# Altium schematic sheet Program_Debug-Interface.SchDoc
size A3
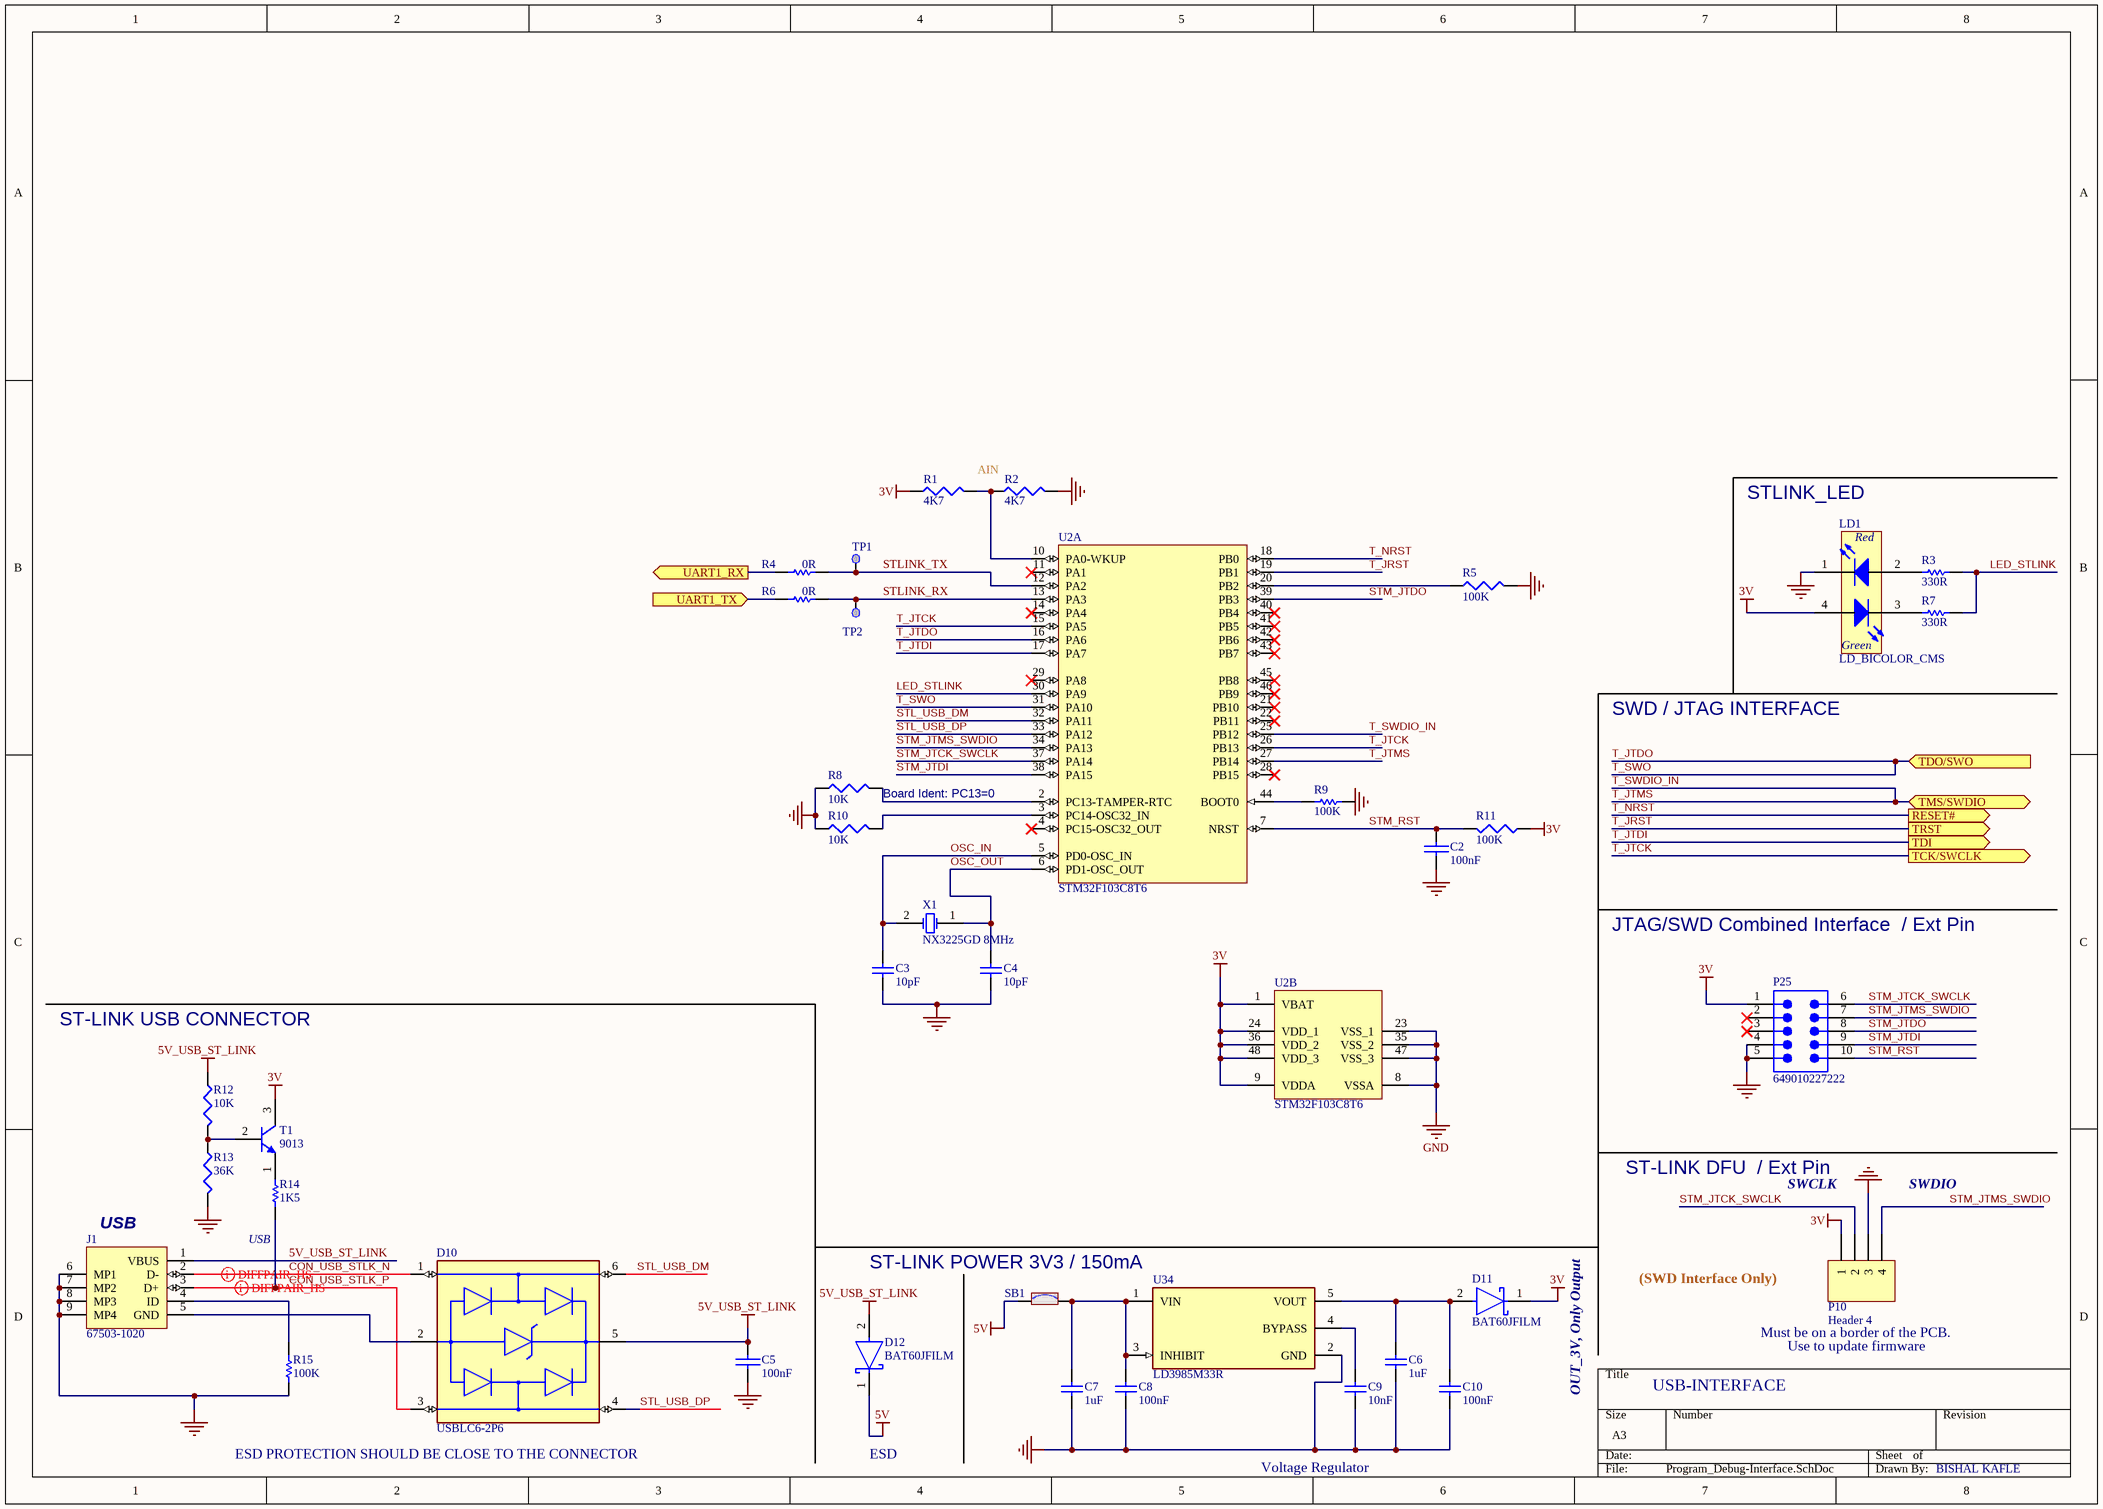
[diagram p0: Program_Debug-Interface.SchDoc]

## Parts
C2  100nF  [0603C]
C3  value 10pF  [C0402]
C4  value 10pF  [C0402]
C5  100nF  [0603C]
C6  value 1uF  [C0603]
C7  value 1uF  [C0603]
C8  value 100nF  [C0402]
C9  value 10nF  [C0402]
C10  value 100nF  [C0402]
D10  USBLC6-2P6  [FP-SOT-666-MFG]
D11  BAT60JFILM  [FP-BAT60JFILM-MFG]
D12  BAT60JFILM  [FP-BAT60JFILM-MFG]
J1  67503-1020  [MOLX-67503-1020_V]
LD1  value LD_BICOLOR_CMS  [LED_BI-GR_HSMF-A201-A00J1]
P10  Header 4  [HDR1X4]
P25  649010227222  [649010227222]
R1  4K7  [0603R]
R2  4K7  [0603R]
R3  value 330R  [R0402]
R4  value 0R  [R0402]
R5  100K  [0603R]
R6  value 0R  [R0402]
R7  value 330R  [R0402]
R8  10K  [0603R]
R9  value 100K  [R0402]
R10  10K  [0603R]
R11  100K  [0603R]
R12  10K  [0603R]
R13  36K  [0603R]
R14  1K5  [0603R]
R15  value 100K  [R0402]
SB1  (no value)  [SOLDER-BRIDGE_R0603-0R]
T1  9013  [SOT23-213]
TP1  Test Point  [TP_SMD_1MM]  (value not drawn)  (no BOM)
TP2  Test Point  [TP_SMD_1MM]  (value not drawn)  (no BOM)
U2  STM32F103C8T6  [STM-LQFP48_L]  (parts A,B of 2)
U34  LD3985M33R  [FP-SOT23-5L-7049676-MFG]
X1  value NX3225GD 8MHz  [CRY_NX3225GD_2P]

## Ports
RESET# (out), TCK/SWCLK (out), TDI (out), TDO/SWO (in), TMS/SWDIO (bidir), TRST (out), UART1_RX (out), UART1_TX (in)

## Nets
3V: D11.1(K) LD1.4(YellowGreen_anode) P10.1 P25.1 R1.1 R11.2 T1.3(C) U2.1(VBAT) U2.9(VDDA) U2.24(VDD_1) U2.36(VDD_2) U2.48(VDD_3)
5V: D12.1(K) SB1.1
5V_USB_ST_LINK: C5.1 D10.5(VBUS) D12.2(A) J1.1(VBUS) R12.1
GND: C2.1 C3.2 C4.2 C5.2 C6.1 C7.2 C8.1 C9.1 C10.1 J1.6(MP1) J1.7(MP2) J1.8(MP3) J1.9(MP4) LD1.1(RED_cathode) P10.3 P25.4 P25.5 R2.2 R5.2 R8.1 R10.1 R13.2 R15.1 U2.8(VSSA) U2.23(VSS_1) U2.35(VSS_2) U2.47(VSS_3) U34.2(GND)
CON_USB_STLK_N: D10.1(I/O1) J1.2(D-)
CON_USB_STLK_P: D10.3(I/O2) J1.3(D+) R14.2
LED_STLINK: R3.2 R7.2 U2.30(PA9)
OSC_IN: C3.1 U2.5(PD0-OSC_IN) X1.2(OSC2)
OSC_OUT: C4.1 U2.6(PD1-OSC_OUT) X1.1(OSC1)
STL_USB_DM: D10.6(I/O1) U2.32(PA11)
STL_USB_DP: D10.4(I/O2) U2.33(PA12)
STLINK_RX: R6.2 TP2.1 U2.13(PA3)
STLINK_TX: R4.1 TP1.1 U2.12(PA2)
STM_JTCK_SWCLK: P10.2 P25.6 U2.37(PA14)
STM_JTDI: P25.9 U2.38(PA15)
STM_JTDO: P25.8 U2.39(PB3)
STM_JTMS_SWDIO: P10.4 P25.7 U2.34(PA13)
STM_RST: C2.2 P25.10 R11.1 U2.7(NRST)
T_JRST: U2.19(PB1) ; port TRST
T_JTCK: U2.15(PA5) U2.26(PB13) ; port TCK/SWCLK
T_JTDI: U2.17(PA7) ; port TDI
T_JTDO: U2.16(PA6) U2.31(PA10) ; port TDO/SWO  [also labelled T_SWO]
T_JTMS: U2.25(PB12) U2.27(PB14) ; port TMS/SWDIO  [also labelled T_SWDIO_IN]
T_NRST: U2.18(PB0) ; port RESET#
UART1_RX: R4.2 ; port UART1_RX
UART1_TX: R6.1 ; port UART1_TX
NetC6_2: C6.2 C10.2 D11.2(A) U34.5(VOUT)
NetC7_1: C7.1 C8.2 SB1.2 U34.1(VIN) U34.3(INHIBIT)
NetC9_2: C9.2 U34.4(BYPASS)
NetD10_2: D10.2(GND) J1.5(GND)
NetJ1_4: J1.4(ID) R15.2
NetLD1_2: LD1.2(Red_anode) R3.1
NetLD1_3: LD1.3(YellowGreen_cathode) R7.1
NetR1_2: R1.2 R2.1 U2.10(PA0-WKUP)
NetR5_1: R5.1 U2.20(PB2)
NetR8_2: R8.2 U2.2(PC13-TAMPER-RTC)
NetR9_2: R9.2 U2.44(BOOT0)
NetR10_2: R10.2 U2.3(PC14-OSC32_IN)
NetR12_2: R12.2 R13.1 T1.2(B)

Not connected (* = marked no-connect by the designer): P25 2* 3*; R9 1; R14 1; T1 1(E); U2 4(PC15-OSC32_OUT)* 11(PA1)* 14(PA4)* 21(PB10)* 22(PB11)* 28(PB15)* 29(PA8)* 40(PB4)* 41(PB5)* 42(PB6)* 43(PB7)* 45(PB8)* 46(PB9)*

## Layout directives
differential pair: CON_USB_STLK_N, CON_USB_STLK_P

## Notes on the sheet
- AIN
- STLINK_LED
- SWD / JTAG INTERFACE
- (near R8) Board Ident: PC13=0
- JTAG/SWD Combined Interface  / Ext Pin
- ST-LINK USB CONNECTOR
- ST-LINK DFU  / Ext Pin
- SWCLK
- SWDIO
- (near J1) USB
- (near R14) USB
- (near SB1) ST-LINK POWER 3V3 / 150mA
- (SWD Interface Only)
- OUT_3V, Only Output
- USB-INTERFACE
- Must be on a border of the PCB.
- Use to update firmware
- (near D10) ESD PROTECTION SHOULD BE CLOSE TO THE CONNECTOR
- ESD
- Voltage Regulator
- BISHAL KAFLE
- Labels drawn without touching a wire or pin: GND
- (in symbol MCD-00051) Red; Green

## Library data of the parts
C2 = CAP
C3 C4 = MCD-00015: Capacitor,10pF,50V,NPO,5%,0402; Manufacturer_Part_Number: CC0402JRNPO9BN100; Manufacturer: YAGEO; Provided_By: SUBCO; Initial_Board_Reference: mb1274; Internal_Part_Number: MCD-00015; ComponentLink1Description: Datasheet; ECCN_US: n/a; ECCN_EU: n/a; Status: Released; Part_Type: Capacitor; Package: C0402; ComponentLink1URL: http://tunmcdsvn.tun.st.com/Component_Datasheet_Library/Trunk/Capacitors/Yageo_Capacitor_NP0_16V-to-50V
C5 = CAP: Capacitor
C6 C7 = MCD-00238: Capacitor,1uF,6V3,X5R,10%,0603; Manufacturer_Part_Number: CC0603KRX5R5BB105; Manufacturer: YAGEO; Provided_By: SUBCO; Initial_Board_Reference: mb1319; Internal_Part_Number: MCD-00238; ComponentLink1Description: Datasheet; ECCN_US: n/a; ECCN_EU: n/a; Status: Released; Part_Type: Capacitor; Package: C0603; ComponentLink1URL: http://tunmcdsvn.tun.st.com/Component_Datasheet_Library/Trunk/Capacitors/Yageo_Multilayer_capacitor_X5R_series_100pF_to_100uF
C8 C10 = MCD-00006: Capacitor,100nF,16V,X7R,10%,0402; Manufacturer_Part_Number: CC0402KRX7R7BB104; Manufacturer: YAGEO; Alternate_Manufacturer: MURATA; Alternate_Manufacturer_Part_Number: GCM155R71C104KA55D; Provided_By: SUBCO; Initial_Board_Reference: mb1274; Internal_Part_Number: MCD-00006; ComponentLink1Description: Datasheet; ECCN_US: n/a; ECCN_EU: n/a; Status: Released; Part_Type: Capacitor; Package: C0402; ComponentLink1URL: http://tunmcdsvn.tun.st.com/Component_Datasheet_Library/Trunk/Capacitors/Yageo_Multilayer_Capacitor_X7R_series_100pF_to_22uF
C9 = MCD-00011: Capacitor,10nF,16V,X7R,10%,0402; Manufacturer_Part_Number: CC0402KRX7R7BB103; Manufacturer: YAGEO; Provided_By: SUBCO; Initial_Board_Reference: mb1274; Internal_Part_Number: MCD-00011; ComponentLink1Description: Datasheet; ECCN_US: n/a; ECCN_EU: n/a; Status: Released; Part_Type: Capacitor; Package: C0402; ComponentLink1URL: http://tunmcdsvn.tun.st.com/Component_Datasheet_Library/Trunk/Capacitors/Yageo_Multilayer_Capacitor_X7R_series_100pF_to_22uF
D10 = CMP-12225-000058-1: TVS DIODE 5.25V 17V SOT666; Min Breakdown Voltage: 6V; Power Line Protection: Yes; Element Configuration: Dual; Test Current: 1mA; Working Voltage: 5V; Number of Channels: 2; Max Reverse Leakage Current: 150nA; Direction: Unidirectional; Peak Pulse Current: 5A; Number of Elements: 1; Capacitance: 3.5pF; Max Breakdown Voltage: 6V; Height: 0.6mm; Depth: 1.3mm; Contact Plating: Tin; Reverse Breakdown Voltage: 6V; REACH SVHC: No SVHC; Operating Supply Voltage: 5V; Width: 1.3mm; Max Operating Temperature: 125°C; Reverse Standoff Voltage: 5V; ESD Protection: Yes; Package Quantity: 1; Termination: SMD/SMT; Length: 1.7mm; Leakage Current: 150nA; Number of Bidirectional Channels: 2; Case/Package: SOT-666; Min Operating Temperature: -40°C; Number of Pins: 6; Clamping Voltage: 17V; Breakdown Voltage: 6V; Lead Free: Lead Free; Radiation Hardening: No; Packaging: Tape and Reel; Mount: Surface Mount; Polarity: Unidirectional
D11 D12 = CMP-12187-000028-1: DIODE SCHOTTKY 10V 3A SOD323; Max Forward Surge Current (Ifsm): 5A; Forward Voltage: 580mV; Max Reverse Leakage Current: 7.5uA; Element Configuration: Single; Polarity: Standard; Output Current: 3A; Contact Plating: Tin; Package Quantity: 1; Mount: Surface Mount; Min Operating Temperature: -65°C; Average Rectified Current: 3A; Packaging: Tape and Reel; Forward Current: 3A; Height: 1.07mm; Length: 1.8mm; REACH SVHC: No SVHC; Peak Non-Repetitive Surge Current: 5A; Max Surge Current: 5A; Width: 1.45mm; Current Rating: 3A; Lead Free: Lead Free; Radiation Hardening: No; Max Reverse Voltage (DC): 10V; Peak Reverse Current: 7.5uA; Voltage Rating (DC): 10V; Max Operating Temperature: 150°C; Max Repetitive Reverse Voltage (Vrrm): 10V; Number of Pins: 2; Weight: 0.01lb
J1 = MOLX-67503-1020: USB, MINI, SMD, RA KME04-USBMU03A01; Manufacturer: Molex; ComponentLink1URL: http://www.molex.com/; PartNumber: 67503-1020; Mounting Technology: Surface Mount; ComponentLink1Description: Manufacturer URL; Terminal Pitch: 0.8 mm; DatasheetVersion: Rev F, 06/2009; ComponentLink2Description: Datasheet; PackageDescription: Mini USB Connector, SMT, Righer Angle; ComponentLink2URL: http://www.molex.com/pdm_docs/sd/675031020_sd.pdf; PackageReference: 67503-1020
LD1 = MCD-00051: LED Bicolor; Manufacturer_Part_Number: HSMF-A201-A00J1; Manufacturer: AVAGO TECHNOLOGIES; Alternate_Manufacturer_Part_Number: LE-RGW35280; Alternate_Manufacturer: EVERLUCK; Part_Type: Display; ECCN_US: EAR99; ECCN_EU: NEC; Provided_By: SUBCO; Initial_Board_Reference: mb1274; Internal_Part_Number: MCD-00051; ComponentLink1Description: Datasheet; Status: Released; ComponentLink1URL: http://tunmcdsvn.tun.st.com/Component_Datasheet_Library/Trunk/Display/Avago_LED-SMC_HSMx-A2xx-02Feb2012
P10 = Header 4: Header, 4-Pin Male; MPN: PEC04SFAN; PN: S1212E-04-ND; URL: http://www.digikey.ca/product-detail/en/PEC04SFAN/S1212E-04-ND
P25 = CMP-1502-00532-2: NexarPartId: 8917592; Number of Positions: 10; Operating Supply Voltage: 600V; Pitch: 4.2mm; Gender: Male; Row Spacing: 5.5118mm; Contact Resistance: 10mΩ; Connector Type: Male Pin, Socket; Insulation: Insulated; Insulation Resistance: 1GΩ; Current Rating: 7A; Contact Plating: Tin; Fastening Type: Ramp; Lead Pitch: 4.2mm; Number of Pins: 10; Contact Gender: Male; Termination: Through Hole; Length: 22.2mm; Max Operating Temperature: 105°C; Housing Material: Nylon; Contact Material: Copper; Voltage Rating: 600V; REACH SVHC: Unknown; Flammability Rating: UL94 V-0; RoHS: Compliant; Height: 12.8mm; Width: 22.3mm; Color: White; Mount: Through Hole; Min Operating Temperature: -40°C; Number of Rows: 2; Number of Contacts: 10
R1 R2 R5 R11 = RES1
R3 R7 = MCD-00062: Resistor,330R,0402,1%,1/16W; Manufacturer_Part_Number: RC0402FR-07330RL; Manufacturer: YAGEO; Provided_By: SUBCO; Initial_Board_Reference: mb1274; Internal_Part_Number: MCD-00062; ComponentLink1Description: Datasheet; ECCN_US: n/a; ECCN_EU: n/a; Status: Released; Part_Type: Resistor; ComponentLink1URL: http://tunmcdsvn.tun.st.com/Component_Datasheet_Library/Trunk/Resistors/Yageo_Resistor_RC0402-series; Package: R0402
R4 R6 = MCD-00052: Resistor,0R,0402,5%,1/16W; Manufacturer_Part_Number: RC0402JR-070RL; Manufacturer: YAGEO; Provided_By: SUBCO; Initial_Board_Reference: mb1274; Internal_Part_Number: MCD-00052; ComponentLink1Description: Datasheet; ECCN_US: n/a; ECCN_EU: n/a; Status: Released; Part_Type: Resistor; ComponentLink1URL: http://tunmcdsvn.tun.st.com/Component_Datasheet_Library/Trunk/Resistors/Yageo_Resistor_RC0402-series; Package: R0402
R8 R10 R12 R13 = R: Right: 20; Bottom: 30
R9 R15 = MCD-00059: Resistor,100K,0402,1%,1/16W; Manufacturer_Part_Number: RC0402FR-07100KL; Manufacturer: YAGEO; Alternate_Manufacturer_Part_Number: RT0402FRE07100KL; Provided_By: SUBCO; Initial_Board_Reference: mb1274; Internal_Part_Number: MCD-00059; Alternate_Manufacturer: YAGEO; ComponentLink1Description: Datasheet; ECCN_US: n/a; ECCN_EU: n/a; Status: Released; Part_Type: Resistor; ComponentLink1URL: http://tunmcdsvn.tun.st.com/Component_Datasheet_Library/Trunk/Resistors/Yageo_Resistor_RC0402-series; Package: R0402
R14 = Res1: Resistor; Value: 1K; Published: 8-Jun-2000; Revision: July-2002: Re-released for DXP Platform.; Publisher: Altium Limited
SB1 = MCD-00071: Solder Bridge ON; Part_Type: Mechanical; Manufacturer: YAGEO; Manufacturer_Part_Number: RC0603JR-070RL; Provided_By: SUBCO; Initial_Board_Reference: mb1274; Internal_Part_Number: MCD-00071; ECCN_US: n/a; ECCN_EU: n/a; Status: Released; ComponentLink1Description: Datasheet; ComponentLink1URL: http://tunmcdsvn.tun.st.com/Component_Datasheet_Library/Trunk/Resistors/Yageo_Resistor_RC0603-series; Package: SB0603
T1 = NPN: NPN Bipolar Transistor; Code - JEDEC: TO-226-AA; Published: 8-Jun-2000; Revision: July-2002: Re-released for DXP Platform.; Publisher: Altium Limited
TP1 TP2 = MCD-00074: Test Point 1mm; Part_Type: Mechanical; Initial_Board_Reference: MB1274; Internal_Part_Number: MCD-00074; Status: Released; Manufacturer_Part_Number: n/a; Manufacturer: n/a; ComponentLink1Description: Datasheet; ComponentLink1URL: http://na; ECCN_US: n/a; ECCN_EU: n/a; Provided_By: n/a
U2 = CMP-0237-00215-3: ARM Cortex-M3 32-bit MCU, 64 KB Flash, 20 KB Internal RAM, 37 I/Os, 48-pin LQFP, -40 to 85 degC, Tray; Supply Voltage(Vcc) min (V): 2; Internal RAM Size (kB): 20; FLASH Size (Prog) (kB): 64; A/D Converter: 2x12-bit (10 Channel); I/Os (High Current): 37; Operating Frequency(F) (Processor speed) (MHz): 72; Core: ARM Cortex-M3; ComponentLink3Description: Package Specification; Mounting Technology: Surface Mount; PartNumber: STM32F103C8T6; PackageReference: LQFP48; Packing: Tray; ComponentLink3URL: http://www.st.com/st-web-ui/static/active/en/resource/technical/document/datasheet/DM00058181.pdf; DatasheetVersion: Rev. 16; ComponentLink1URL: http://www.st.com/web/en/home.html; PackageVersion: Rev. 6, 06/2013; ComponentLink2URL: http://www.st.com/st-web-ui/static/active/en/resource/technical/document/datasheet/CD00161566.pdf; ComponentLink1Description: Manufacturer URL; ComponentLink2Description: Datasheet; PackageDescription: 48-Pin Low Profile Quad Flat Package, 7 x 7 mm Body, 0.5 mm Pitch
U34 = CMP-0244-00328-3: NexarPartId: 526998; Min Output Voltage: 3.3V; Min Input Voltage: 2.5V; Max Junction Temperature (Tj): 125°C; Min Current Limit: 300mA; Input Bias Current: 85µA; Max Supply Voltage: 6V; Quiescent Current: 150µA; Max Output Current: 150mA; Number of Channels: 1; Output Type: Fixed; Output Voltage Accuracy: 2%; Polarity: Positive; Dropout Voltage: 60mV; Width: 1.75mm; Height: 1.3mm; Lifecycle Status: Production; Case/Package: SOT-23; RoHS: Compliant; Output Current: 150mA; Radiation Hardening: No; Number of Regulators: 1; Max Operating Temperature: 125°C; Output Voltage: 3.3V; Min Supply Voltage: 2.5V; Min Operating Temperature: -40°C; Accuracy: 2%; Number of Outputs: 1; Number of Pins: 5; Packaging: Cut Tape (CT); Lead Free: Lead Free; Schedule B: 8542390000, 8542390000; Mount: Surface Mount; Max Input Voltage: 6V; Length: 3mm
X1 = MCD-00092: Crystal 8Mhz, 8pF, -+50PPM, SMD; Manufacturer_Part_Number: NX3225GD 8MHz EXS00A-CG04874; Manufacturer: NDK; Part_Type: Crystal_Osc; BMS_Part_Number: 9157029; ECCN_US: EAR99; ECCN_EU: NEC; Provided_By: SUBCO; Initial_Board_Reference: mb1274; Internal_Part_Number: MCD-00092; ComponentLink1Description: Datasheet; Status: Released; ComponentLink1URL: http://tunmcdsvn.tun.st.com/Component_Datasheet_Library/Trunk/Crystal_Osc/NDK_Crystal-For-ST_NX3225GD 8MHz EXS00A-CG04874 (EXS10B-20725)